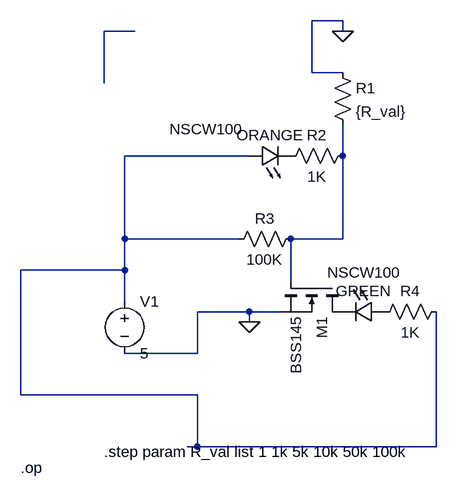
[diagram p0: schematic led.asc]
led.asc, the LTspice schematic file:
Version 4.1
SHEET 1 900 720
WIRE 208 16 160 16
WIRE -112 32 -160 32
WIRE 208 32 208 16
WIRE 160 96 160 16
WIRE 208 96 160 96
WIRE -160 112 -160 32
WIRE 64 224 -128 224
WIRE 208 224 208 176
WIRE -128 352 -128 224
WIRE 48 352 -128 352
WIRE 208 352 208 224
WIRE 208 352 128 352
WIRE -128 400 -128 352
WIRE -128 400 -288 400
WIRE 128 416 128 352
WIRE -128 448 -128 400
WIRE 64 464 -16 464
WIRE 112 464 64 464
WIRE 64 480 64 464
WIRE -16 528 -16 464
WIRE -16 528 -128 528
WIRE -288 592 -288 400
WIRE -16 592 -288 592
WIRE -16 672 -16 592
WIRE -16 672 -32 672
WIRE 352 672 352 464
WIRE 352 672 -16 672
FLAG 208 32 0
FLAG 64 480 0
SYMBOL res 192 80 R0
SYMATTR InstName R1
SYMATTR Value {R_val}
SYMBOL res 224 208 R90
WINDOW 0 0 56 VBottom 2
WINDOW 3 32 56 VTop 2
SYMATTR InstName R2
SYMATTR Value 1K
SYMBOL res 144 336 R90
WINDOW 0 0 56 VBottom 2
WINDOW 3 32 56 VTop 2
SYMATTR InstName R3
SYMATTR Value 100K
SYMBOL nmos 208 416 R90
SYMATTR InstName M1
SYMATTR Value BSS145
SYMBOL LED 272 448 R90
WINDOW 0 0 32 VBottom 2
WINDOW 3 -60 31 VTop 2
SYMATTR InstName GREEN
SYMATTR Value NSCW100
SYMATTR Description Diode
SYMATTR Type diode
SYMBOL LED 64 240 R270
WINDOW 0 32 32 VTop 2
WINDOW 3 73 -66 VBottom 2
SYMATTR InstName ORANGE
SYMATTR Value NSCW100
SYMATTR Description Diode
SYMATTR Type diode
SYMBOL res 368 448 R90
WINDOW 0 0 56 VBottom 2
WINDOW 3 32 56 VTop 2
SYMATTR InstName R4
SYMATTR Value 1K
SYMBOL voltage -128 432 R0
WINDOW 123 0 0 Left 0
WINDOW 39 0 0 Left 0
SYMATTR InstName V1
SYMATTR Value 5
TEXT -160 680 Left 2 !.step param R_val list 1 1k 5k 10k 50k 100k
TEXT -288 704 Left 2 !.op

The netlist it stands for:
* led.asc
R1 0 N003 {R_val}
R2 N003 P001 1K
R3 N003 N002 100K
M1 P002 N003 0 0 BSS145
D§GREEN P003 P002 NSCW100
D§ORANGE N002 P001 NSCW100
R4 N002 P003 1K
V1 N002 0 5
.model D D
.lib standard.dio
.model NMOS NMOS
.model PMOS PMOS
.lib standard.mos
.step param R_val list 1 1k 5k 10k 50k 100k
.op
.backanno
.end